# Altium schematic sheet powersupply.SchDoc
size A; SheetNumber: 1; SheetTotal: 1
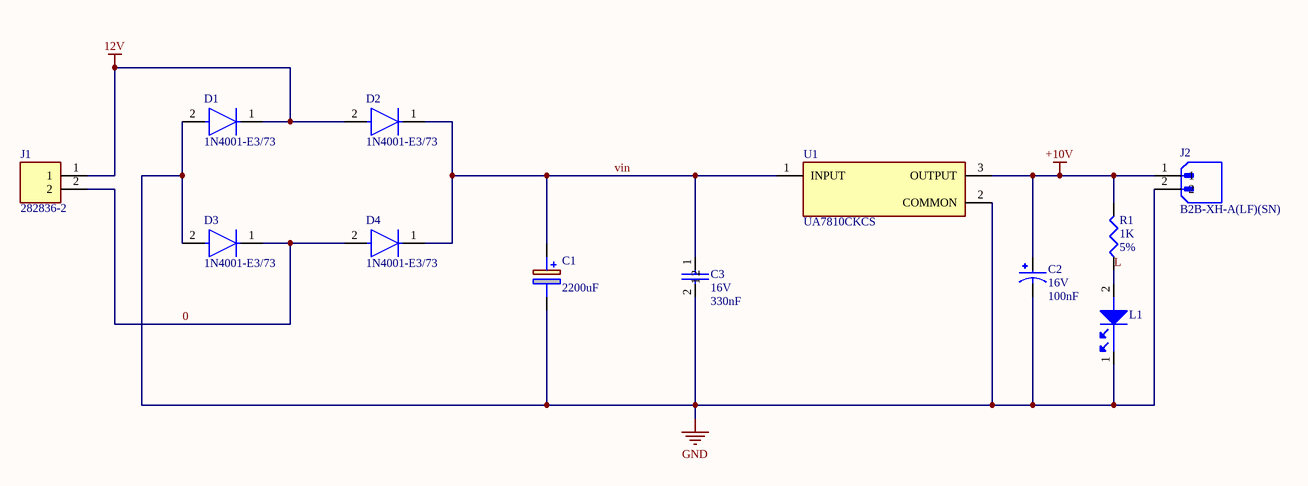
[diagram p0: powersupply.SchDoc]

## Parts
C1  value 2200uF  [CAPPRD500W60D1275H2200]  (hidden comment: MAL217255222E3)
C2  Voltage: 16V  [100nF_Capacitor - duplicate]  (hidden comment: 100nF)
C3  Voltage: 16V  [330nF_Capacitor - duplicate1]  (hidden comment: 330nF)
D1  1N4001-E3/73  [FP-1N4001-E3-73-MFG]
D2  1N4001-E3/73  [FP-1N4001-E3-73-MFG]
D3  1N4001-E3/73  [FP-1N4001-E3-73-MFG]
D4  1N4001-E3/73  [FP-1N4001-E3-73-MFG]
J1  282836-2  [TE_282836-2]
J2  B2B-XH-A(LF)(SN)  [JST_B2B-XH-A(LF)(SN)]
L1  WP7113SRD/J4  [LEDRD254W57D500H1070]  (value not drawn)
R1  Resistance: 1K  Tolerance: 5%  [Resister]  (hidden comment: CFM12JT1K00)
U1  UA7810CKCS  [FP-KCS0003B-MFG]

## Nets
12V: D1.1(C) D2.2(A) J1.1
+10V: C2.1 J2.1 R1.2 U1.3(OUTPUT)
GND: C1.2(-) C2.2 C3.2 D1.2(A) D3.2(A) J2.2 L1.1 U1.2(COMMON)
0: D3.1(C) D4.2(A) J1.2
L: L1.2 R1.1
vin: C1.1(+) C3.1 D2.1(C) D4.1(C) U1.1(INPUT)

## Library data of the parts
C1 = MAL217255222E3: Aluminum Electrolytic Capacitors Radial Miniature, Low Impedance, Automotive Grade; Manufacturer_Name: Vishay; Geometry.Height: 22mm; Mouser Part Number: 594-MAL217255222E3; Mouser Price/Stock: https://www.mouser.co.uk/ProductDetail/Vishay/MAL217255222E3?qs=vvQtp7zwQdMUHaQVE2Z5WQ%3D%3D; Manufacturer_Part_Number: MAL217255222E3; Datasheet Link: https://www.vishay.com/docs/28499/172rlx.pdf
C2 = 100nF: Aluminum Electrolytic Capacitor, Polarized, Aluminum (wet), 50V, 20% +Tol, 20% -Tol, 100nF, Through Hole Mount; Manufacturer: Panasonic; Manufacturer Part Number: EEA-GA1C100; Manufacturer Series: GA; Dielectric Material: Aluminium; Leakage Current: 3uA; Ripple Current: 30mA; Tan Delta: 0.18; Supplier: Mouser; Supplier Part Number: 667-EEA-GA1C100; RoHS: Yes; Category: Aluminum Electrolytic Capacitors; Stock: 3224; Pricing: 1=0.32, 10=0.216, 50=0.144, 100=0.123, 1000=0.086, 10000=0.086 (USD); Mounting Technology: Through Hole; Pins: 2; Package Shape: Cylindrical; Terminal Finish: Tin; Min Operating Temperature: -55°C; Max Operating Temperature: 105°C; JESD-609 Code: e3; Polarity: Polarized; Capacitor Type: Aluminium; Tolerance  (fill in as +-): 20%; Package Style: RadialMeter; Packaging: Bulk; Tolerance (fill in as +-): 20%; Rated DC Voltage (URdc): 16V; Series: EEA-GA; Termination: Wire; Diameter: 4mm; Length: 7mm; Terminal Pitch: 1.5mm; Reach SVHC Compliant: Yes; RoHS Compliant: Yes; ComponentLink1URL: https://datasheet.ciiva.com:443/pdfs/VipMasterIC/IC/PANA/PANA-S-A0007980152/PANA-S-A0007980152-1.pdf?src-supplier=IHS+Markit; ComponentLink1Description: https://datasheet.ciiva.com:443/pdfs/VipMasterIC/IC/PANA/PANA-S-A0007980152/PANA-S-A0007980152-1.pdf?src-supplier=IHS+Markit; ComponentLink2URL: https://datasheet.ciiva.com/11783/0900766b800bd184-11783675.pdf?src-supplier=Rs; ComponentLink2Description: https://datasheet.ciiva.com/11783/0900766b800bd184-11783675.pdf?src-supplier=Rs; ComponentLink3URL: https://datasheet.ciiva.com/30132/61aba0000ce99-30132280.pdf?src-supplier=Onlinecomponents.com; ComponentLink3Description: https://datasheet.ciiva.com/30132/61aba0000ce99-30132280.pdf?src-supplier=Onlinecomponents.com; ComponentLink4URL: https://datasheet.ciiva.com/2984/aba0000ce99-2984970.pdf?src-supplier=Avnet; ComponentLink4Description: https://datasheet.ciiva.com/2984/aba0000ce99-2984970.pdf?src-supplier=Avnet; ComponentLink5URL: https://datasheet.ciiva.com/14606/70256146-14606495.pdf?src-supplier=Allied+Electronics; ComponentLink5Description: https://datasheet.ciiva.com/14606/70256146-14606495.pdf?src-supplier=Allied+Electronics; ComponentLink6URL: https://datasheet.ciiva.com/43461/1521263-43461069.pdf?src-supplier=Farnell; ComponentLink6Description: https://datasheet.ciiva.com/43461/1521263-43461069.pdf?src-supplier=Farnell; ComponentLink7URL: https://datasheet.ciiva.com/24024/aba0000ce99-48764-24024622.pdf?src-supplier=Mouser; ComponentLink7Description: https://datasheet.ciiva.com/24024/aba0000ce99-48764-24024622.pdf?src-supplier=Mouser; Capacitance: 100nF
C3 = 330nF: Ceramic Capacitor, Ceramic, 16V, 10% +Tol, 10% -Tol, SL0, 120ppm/Cel TC, 330nF, Through Hole Mount; Manufacturer: Vishay BCcomponents; Manufacturer Part Number: S220K25SL0N63L6R; Supplier: Mouser; Supplier Part Number: 594-S220K25SL0N63L6R; RoHS: Yes; Category: Ceramic Capacitors; Stock: 23582; Pricing: 1=0.4, 10=0.197, 50=0.197, 100=0.169, 1000=0.107, 10000=0.095 (USD); Pins: 2; Dielectric Material: Ceramic; Capacitor Type: Ceramic; RoHS Compliant: Yes; ComponentLink1URL: https://datasheet.ciiva.com:443/pdfs/VipMasterIC/IC/VISH/VISH-S-A0003941534/VISH-S-A0003941534-1.pdf?src-supplier=IHS+Markit; ComponentLink1Description: https://datasheet.ciiva.com:443/pdfs/VipMasterIC/IC/VISH/VISH-S-A0003941534/VISH-S-A0003941534-1.pdf?src-supplier=IHS+Markit; ComponentLink2URL: https://datasheet.ciiva.com/148/geninfo-cd-rfi-safcaps-148963.pdf?src-supplier=Digi-Key; ComponentLink2Description: https://datasheet.ciiva.com/148/geninfo-cd-rfi-safcaps-148963.pdf?src-supplier=Digi-Key; ComponentLink3URL: https://datasheet.ciiva.com/7974/gapkap-7974888.pdf?src-supplier=Element14; ComponentLink3Description: https://datasheet.ciiva.com/7974/gapkap-7974888.pdf?src-supplier=Element14; Capacitance: 330nF
D1-D4 = CMP-02540-000001-1: DIODE GEN PURP 50V 1A DO204AL; Manufacturer: Vishay; Max Surge Forward Current: 30A; Value: 15pF; Peak Reverse Current: 5uA; Max Junction Temp: +150°C; Lead Free: Yes; Manufacturer Part Number: 1N4001-E3/73; Height: 2.7mm; Digikey Description: DIODE GEN PURP 50V 1A DO204AL; Reverse Voltage: 50V; Package: 1N4001-E3/73; RoHS: TRUE; Temperature: -50°C to +150°C; Device Class L2: Diodes; Forward Current: 1A; Max Repetitive Reverse Voltage: 50V; Device Class L1: Discrete Semiconductors; Device Class L3: Rectifier Diodes; Capacitance: 15pF; Temperature Range High: +150°C; Category: Diode; Ipc Land Pattern Name: DIOPA1088W105L520D270; ComponentLink2URL: http://www.vishay.com/docs/88503/1n4001.pdf; Octopart: https://octopart.com/1n4001-e3%2F73-vishay-42330130; Automotive: No; ComponentLink2Description: Datasheet; Temperature Range Low: -50°C; Mouser Description: Rectifiers Vr/50V Io/1A
J1 = 282836-2: Terminal Block Connector Wire Receptacle 2 5 mm 30-16 AWG Green 13.5 A 300 V | TE Connectivity 282836-2; SnapEDA_Link: https://www.snapeda.com/parts/282836-2/TE+Connectivity+AMP+Connectors/view-part/?ref=snap; Package: None; Value: *; MF: TE Connectivity; MP: 282836-2; Check_prices: https://www.snapeda.com/parts/282836-2/TE+Connectivity+AMP+Connectors/view-part/?ref=eda
J2 = B2B-XH-A(LF)(SN): Connector Header Through Hole 2 position 0.098 (2.50mm); MF: JST Sales America Inc.; SnapEDA_Link: https://www.snapeda.com/parts/B2B-XH-A(LF)(SN)/JST+Sales+America+Inc./view-part/?ref=snap; Package: None; Value: *; MP: B2B-XH-A(LF)(SN); Check_prices: https://www.snapeda.com/parts/B2B-XH-A(LF)(SN)/JST+Sales+America+Inc./view-part/?ref=eda
L1 = WP7113SRD/J4: LED Uni-Color SB. Red 660nm 2-Pin T-1 3/4 Bulk; Manufacturer: Kingbright; Supplier: Digi-Key; Supplier Part Number: 754-2139-ND; Manufacturer Part Number: WP7113SRD/J4; RoHS: No; Category: LEDs; Stock: 14375; Pricing: 1=0.69, 10=0.448, 100=0.2936, 1000=0.23175, 2000=0.2163, 5000=0.20858, 10000=0.20549, 25000=0.20085 (USD); ComponentLink1URL: http://www.kingbrightusa.com/images/catalog/SPEC/WP7113SRD-J4.pdf?src-supplier=Digi-Key; ComponentLink1Description: http://www.kingbrightusa.com/images/catalog/SPEC/WP7113SRD-J4.pdf?src-supplier=Digi-Key
R1 = CFM12JT1K00: Fixed Resistor, Carbon Film, 0.5W, 1000ohm, 350V, 5% +/-Tol, -400,0ppm/Cel, Through Hole Mount; Manufacturer: Stackpole Electronics; Power: 500mW; Rated Temperature: 70°C; Value: 1kR; Temperature Coefficient: 400ppm/°C; Lead Diameter: 0.55mm; Lead Length: 28mm; Package Diameter: 2.3mm; Package Length: 6mm; Supplier: Digi-Key; Supplier Part Number: S1KHCT-ND; Manufacturer Part Number: CFM12JT1K00; RoHS: Yes; Category: Through-Hole Resistors; Stock: 145304; Pricing: 1=0.1, 10=0.067, 25=0.0488, 50=0.0372, 100=0.0274, 250=0.02092, 500=0.01672, 1000=0.01231 (USD); Mounting Technology: Through Hole; Pins: 2; Package Shape: Tubular; Terminal Finish: Tin; Min Operating Temperature: -55°C; Max Operating Temperature: 155°C; Resistor Type: FIXED RESISTOR; Construction: Tubular; Package Style: AxialMeter; Packaging: Tape and Reel; Technology: CARBON FILM; Termination: Wire; Working Voltage: 350V; JESD-609 Code: e3; Reach SVHC Compliant: Yes; RoHS Compliant: Yes; ComponentLink1URL: https://datasheet.ciiva.com:443/pdfs/VipMasterIC/IC/SEIE/SEIE-S-A0009883960/SEIE-S-A0009883960-1.pdf?src-supplier=IHS+Markit; ComponentLink1Description: https://datasheet.ciiva.com:443/pdfs/VipMasterIC/IC/SEIE/SEIE-S-A0009883960/SEIE-S-A0009883960-1.pdf?src-supplier=IHS+Markit; ComponentLink2URL: http://components.arrow.com/part/dataview/51859118S46073N1174?src-supplier=Arrow+Electronics; ComponentLink2Description: http://components.arrow.com/part/dataview/51859118S46073N1174?src-supplier=Arrow+Electronics; ComponentLink3URL: https://www.seielect.com/Catalog/SEI-CF_CFM.pdf?src-supplier=Digi-Key; ComponentLink3Description: https://www.seielect.com/Catalog/SEI-CF_CFM.pdf?src-supplier=Digi-Key; ComponentLink4URL: https://www.seielect.com/catalog/SEI-Packaging.pdf?src-supplier=Digi-Key; ComponentLink4Description: https://www.seielect.com/catalog/SEI-Packaging.pdf?src-supplier=Digi-Key; ComponentLink5URL: https://www.seielect.com/catalog/SEI-CF_CFM.pdf?src-supplier=Avnet; ComponentLink5Description: https://www.seielect.com/catalog/SEI-CF_CFM.pdf?src-supplier=Avnet; ComponentLink6URL: https://www.verical.com/server-webapp/html/getDatasheet?partID=470997&src-supplier=Verical; ComponentLink6Description: https://www.verical.com/server-webapp/html/getDatasheet?partID=470997&src-supplier=Verical
U1 = CMP-04917-000126-1: IC REG LINEAR 10V 1.5A TO220-3; Output Type: Fixed; Number of Regulators: 1; Dropout Voltage: 2V; Min Output Voltage: 9.5V; Power Supply Rejection Ratio (PSRR): 71dB; Min Input Voltage: 12.5V; Quiescent Current: 8mA; Polarity: Positive; Max Output Voltage: 10.5V; Max Input Voltage: 28V; REACH SVHC: No SVHC; Height: 8.7mm; Lead Free: Lead Free; Mount: Through Hole; Number of Pins: 3; Nominal Output Voltage: 10V; RoHS Compliant: Yes; Radiation Hardening: No; Case/Package: TO-220; Package Quantity: 50; Width: 4.58mm; Max Output Current: 1.5A; Min Operating Temperature: 0°C; Packaging: Rail/Tube; Length: 10.16mm; Weight: 0.067197oz; Number of Outputs: 1; Output Voltage: 10V; Max Operating Temperature: 125°C; Output Current: 1.5A